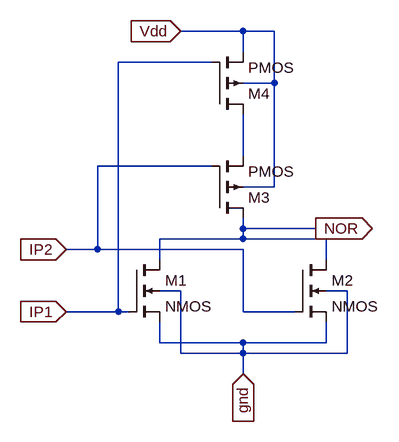
[diagram p0: schematic nor.asc]
nor.asc, the LTspice schematic file:
Version 4
SHEET 1 880 680
WIRE 336 -192 240 -192
WIRE 384 -192 336 -192
WIRE 336 -160 336 -192
WIRE 288 -144 144 -144
WIRE 384 -112 384 -192
WIRE 384 -112 336 -112
WIRE 336 0 336 -64
WIRE 288 16 112 16
WIRE 384 48 384 -112
WIRE 384 48 336 48
WIRE 336 112 336 96
WIRE 448 112 336 112
WIRE 336 128 336 112
WIRE 336 128 208 128
WIRE 464 128 336 128
WIRE 112 144 112 16
WIRE 112 144 64 144
WIRE 336 144 112 144
WIRE 208 160 208 128
WIRE 464 160 464 128
WIRE 240 208 208 208
WIRE 496 208 464 208
WIRE 144 240 144 -144
WIRE 144 240 64 240
WIRE 160 240 144 240
WIRE 336 240 336 144
WIRE 416 240 336 240
WIRE 208 288 208 256
WIRE 336 288 208 288
WIRE 464 288 464 256
WIRE 464 288 336 288
WIRE 240 304 240 208
WIRE 336 304 336 288
WIRE 336 304 240 304
WIRE 496 304 496 208
WIRE 496 304 336 304
WIRE 336 336 336 304
FLAG 64 240 IP1
IOPIN 64 240 In
FLAG 64 144 IP2
IOPIN 64 144 In
FLAG 448 112 NOR
IOPIN 448 112 Out
FLAG 240 -192 Vdd
IOPIN 240 -192 In
FLAG 336 336 gnd
IOPIN 336 336 In
SYMBOL nmos4 160 160 R0
SYMATTR InstName M1
SYMBOL nmos4 416 160 R0
SYMATTR InstName M2
SYMBOL pmos4 288 96 M180
SYMATTR InstName M3
SYMBOL pmos4 288 -64 M180
SYMATTR InstName M4

The netlist it stands for:
* nor.asc
M1 NOR IP1 gnd gnd NMOS
M2 NOR IP2 gnd gnd NMOS
M3 NOR IP2 N001 Vdd PMOS
M4 N001 IP1 Vdd Vdd PMOS
.model NMOS NMOS
.model PMOS PMOS
.lib standard.mos
.backanno
.end